# Altium schematic sheet Sheet1.SchDoc
size 594 x 420 mm; SheetNumber: 1; SheetTotal: 1
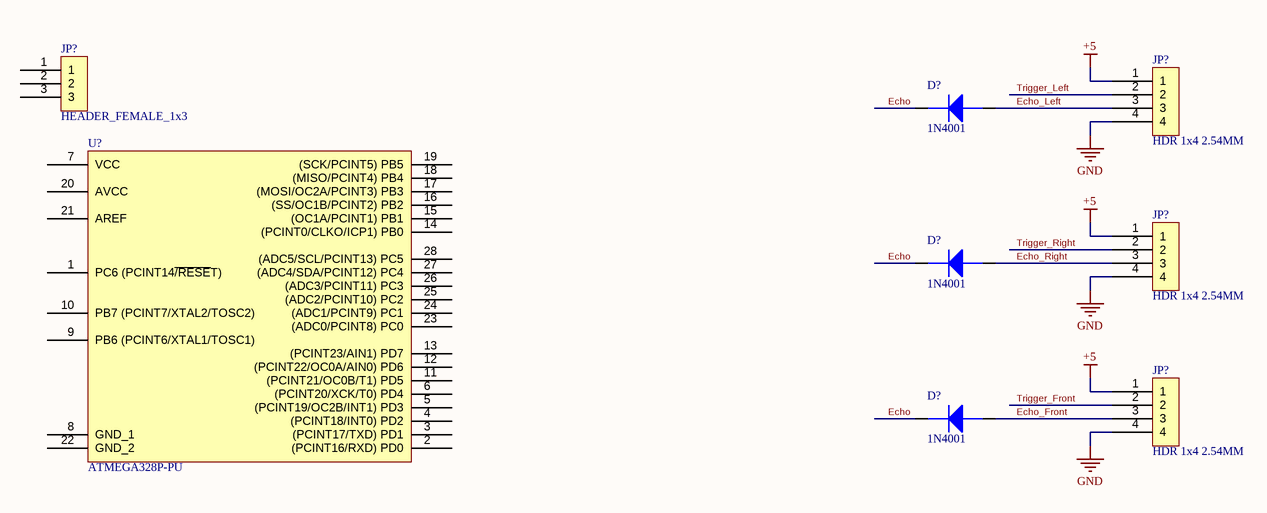
[diagram p0: Sheet1.SchDoc]

## Parts
(Parts that share a designator on the sheet are numbered #1, #2 ... from top to bottom, then left to right.)
D?#1  1N4001  [1N4001]
D?#2  1N4001  [1N4001]
D?#3  1N4001  [1N4001]
JP?#1  HEADER_FEMALE_1x3  [HDR_1x3_2.54MM]
JP?#2  HDR 1x4 2.54MM  [MALEHEADER_1x4_2.54MM]
JP?#3  HDR 1x4 2.54MM  [MALEHEADER_1x4_2.54MM]
JP?#4  HDR 1x4 2.54MM  [MALEHEADER_1x4_2.54MM]
U?  ATMEGA328P-PU  [DIP28_7.62mm]

## Nets
+5: JP?#2.1 JP?#3.1 JP?#4.1
GND: JP?#2.4 JP?#3.4 JP?#4.4
Echo: D?#1.1(Ca) D?#2.1(Ca) D?#3.1(Ca)
Echo_Front: D?#3.2(An) JP?#4.3
Echo_Left: D?#1.2(An) JP?#2.3
Echo_Right: D?#2.2(An) JP?#3.3
Trigger_Front: JP?#4.2
Trigger_Left: JP?#2.2
Trigger_Right: JP?#3.2

Not connected (* = marked no-connect by the designer): JP?#1 1 2 3; U? 1(PC6_(PCINT14~{/RESE}T)) 2((PCINT16/RXD)_PD0) 3((PCINT17/TXD)_PD1) 4((PCINT18/INT0)_PD2) 5((PCINT19/OC2B/INT1)_PD3) 6((PCINT20/XCK/T0)_PD4) 7(VCC) 8(GND_1) 9(PB6_(PCINT6/XTAL1/TOSC1)) 10(PB7_(PCINT7/XTAL2/TOSC2)) 11((PCINT21/OC0B/T1)_PD5) 12((PCINT22/OC0A/AIN0)_PD6) 13((PCINT23/AIN1)_PD7) 14((PCINT0/CLKO/ICP1)_PB0) 15((OC1A/PCINT1)_PB1) 16((SS/OC1B/PCINT2)_PB2) 17((MOSI/OC2A/PCINT3)_PB3) 18((MISO/PCINT4)_PB4) 19((SCK/PCINT5)_PB5) 20(AVCC) 21(AREF) 22(GND_2) 23((ADC0/PCINT8)_PC0) 24((ADC1/PCINT9)_PC1) 25((ADC2/PCINT10)_PC2) 26((ADC3/PCINT11)_PC3) 27((ADC4/SDA/PCINT12)_PC4) 28((ADC5/SCL/PCINT13)_PC5)

## Notes on the sheet
- DWG NO:
- REV:
- THIS DOCUMENT AND THE DATA DISCLOSED HEREIN OR
- HEREWITH IS THE PROPERTY OF ALTIUM LIMITED AND MAY
- BE FREELY DISTRIBUTED IN WHOLE. NO RIGHTS ARE
- RESERVED OR EXPRESS OR IMPLIED WARANTEE GIVEN.
- REVISION
- DESCRIPTION
- DATE
- APPROVED
- ENG:
- APPROVALS
- PROJECT
- DSN:
- CHK:
- REFERENCE DOCUMENTS
- PROJECT REVISION:
- TITLE
- DOCUMENT REVISION:
- DESIGN ITEM:
- BOM:
- FAB DWG:
- PCB DWG:
- ASSY DWG:
- SCALE:
- A2
- SIZE
- CAGE CODE
- FILE NAME
- DWG NO.
- SHEET
- OF
- REV

## Library data of the parts
D?#1-D?#3 = 1N4001: Rectifier Diode, 1 Element, 1A, 50V V(RRM), Silicon, DO-41; Manufacturer: ON Semiconductor / Fairchild; Max Reverse Current: 5uA; Max Surge Current: 30A; Element Configuration: Single; Forward Voltage: 1.1V; Polarity: Standard; Capacitance: 15pF; Power Dissipation: 3W; Supplier 1: Avnet; Manufacturer Part Number: 1N4001; RoHS: Yes; Category: Rectifier Diodes; Stock 1: 326522; Pricing 1: 32052=0.01000 (USD); Mount: Through Hole; Number of Pins: 2; Contact Plating: Tin,Matte; Weight: 0.245g; Min Operating Temperature: -55°C; Max Operating Temperature: 175°C; Packaging: Tape and Reel; Max Repetitive Reverse Voltage (Vrrm): 50V; Max Forward Surge Current (Ifsm): 30A; Package Quantity: 1000; Average Rectified Current: 1A; Peak Non-Repetitive Surge Current: 30A; Max Reverse Voltage (DC): 50V; Reverse Voltage: 50V; Forward Current: 1A; Voltage Rating (DC): 50V; Current Rating: 1A; Output Current: 1A; Diameter: 2.72mm; Length: 5.2mm; Width: 0.25inch; Height: 5.2mm; Radiation Hardening: No; RoHS Compliant: Yes; REACH SVHC: No SVHC; Lead Free: Lead Free; ComponentLink1URL: https://datasheet.ciiva.com/910/1n4001-910352.pdf?src-supplier=Avnet; ComponentLink1Description: https://datasheet.ciiva.com/910/1n4001-910352.pdf?src-supplier=Avnet; ComponentLink2URL: https://datasheet.ciiva.com/910/1n4001-910352.pdf?src-supplier=Digi-Key; ComponentLink2Description: https://datasheet.ciiva.com/910/1n4001-910352.pdf?src-supplier=Digi-Key; ComponentLink3URL: https://datasheet.ciiva.com/4452/1n4004-81693-4452416.pdf?src-supplier=Mouser; ComponentLink3Description: https://datasheet.ciiva.com/4452/1n4004-81693-4452416.pdf?src-supplier=Mouser; ComponentLink4URL: https://datasheet.ciiva.com/30479/0900766b810c07cd-30479188.pdf?src-supplier=RSComponents; ComponentLink4Description: https://datasheet.ciiva.com/30479/0900766b810c07cd-30479188.pdf?src-supplier=RSComponents; ComponentLink5URL: https://datasheet.ciiva.com/15208/getdatasheetpartid-148723-15208346.pdf?src-supplier=Verical; ComponentLink5Description: https://datasheet.ciiva.com/15208/getdatasheetpartid-148723-15208346.pdf?src-supplier=Verical; ComponentLink6URL: https://datasheet.ciiva.com/8084/1n4007-8084076.pdf?src-supplier=Avnet; ComponentLink6Description: https://datasheet.ciiva.com/8084/1n4007-8084076.pdf?src-supplier=Avnet; ComponentLink7URL: https://datasheet.ciiva.com/910/1n4001-910353.pdf?src-supplier=Digi-Key; ComponentLink7Description: https://datasheet.ciiva.com/910/1n4001-910353.pdf?src-supplier=Digi-Key; ComponentLink8URL: https://datasheet.ciiva.com/927/1n4001-d-927540.pdf?src-supplier=Digi-Key; ComponentLink8Description: https://datasheet.ciiva.com/927/1n4001-d-927540.pdf?src-supplier=Digi-Key; ComponentLink9URL: https://datasheet.ciiva.com/22651/1923868-22651932.pdf?src-supplier=Element14; ComponentLink9Description: https://datasheet.ciiva.com/22651/1923868-22651932.pdf?src-supplier=Element14; ComponentLink10URL: https://datasheet.ciiva.com/22685/1504060-22685765.pdf?src-supplier=Element14; ComponentLink10Description: https://datasheet.ciiva.com/22685/1504060-22685765.pdf?src-supplier=Element14; Supplier Part Number 1: 1N4001
JP?#1 = 68000-103HLF: Conn Unshrouded Header HDR 3 POS 2.54mm Solder ST Top Entry Thru-Hole BergStik® Automotive Bulk; Manufacturer: Amphenol ICC; Supplier 1: Allied Electronics; Manufacturer Part Number: 68000-103HLF; RoHS: Yes; Category: Headers and Wire Housings; RoHS Compliant: Yes; ComponentLink1URL: http://www.farnell.com/cad/1914865.pdf?src-supplier=Farnell; ComponentLink1Description: http://www.farnell.com/cad/1914865.pdf?src-supplier=Farnell; ComponentLink2URL: http://www.farnell.com/cad/1914865.pdf?src-supplier=Element14; ComponentLink2Description: http://www.farnell.com/cad/1914865.pdf?src-supplier=Element14; ComponentLink3URL: http://www.farnell.com/cad/1914865.pdf?src-supplier=Newark; ComponentLink3Description: http://www.farnell.com/cad/1914865.pdf?src-supplier=Newark; ComponentLink4URL: https://cdn.amphenol-icc.com/media/wysiwyg/files/drawing/68000.pdf?src-supplier=Digi-Key; ComponentLink4Description: https://cdn.amphenol-icc.com/media/wysiwyg/files/drawing/68000.pdf?src-supplier=Digi-Key; Supplier Part Number 1: 70236888
JP?#2-JP?#4 = 68001-204HLF: Conn Unshrouded Header HDR 4 POS 2.54mm Solder ST Thru-Hole Bag; Manufacturer: Amphenol ICC / FCI; Supplier 1: Allied Electronics; Manufacturer Part Number: 68001-204HLF; RoHS: No; Category: Headers and Wire Housings; Supplier Part Number 1: 70302499
U? = ATMEGA328P-PU: ATMEGA328P-PU; 8 bit Microcontroller AVR 20MHz 1; 32kb Flash; 2kb RAM; I2C SPI 2; Manufacturer: Microchip / Atmel; Number of PWM Channels: 6; Number of Timers/Counters: 3; Min Supply Voltage: 1.8V; Max Supply Voltage: 5.5V; Interface: I2C,SPI,UART,USART,2-Wire; Number of I/Os: 23; Oscillator Type: Internal; Data Bus Width: 8b; Number of SPI Channels: 1; Watchdog Timer: Yes; Peripherals: Brown-out Detect/Reset,POR,PWM,WDT; Supplier 1: Allied Electronics; Manufacturer Part Number: ATMEGA328P-PU; RoHS: Yes; Category: Microcontrollers; Mount: Through Hole; Case/Package: PDIP; Number of Pins: 28; Contact Plating: Tin,Matte; Min Operating Temperature: -40°C; Max Operating Temperature: 85°C; Package Quantity: 14; Core Architecture: AVR; RAM Size: 2KB; Number of ADC Channels: 6; Packaging: Rail/Tube; Frequency: 20MHz; Number of Programmable I/O: 23; Max Frequency: 20MHz; Number of I2C Channels: 1; Memory Type: FLASH; Memory Size: 32KB; Series: AVR® ATmega; Length: 37.4mm; Width: 6.76mm; Height: 3.28mm; Radiation Hardening: No; REACH SVHC: No SVHC; Lead Free: Lead Free; RoHS Compliant: Yes; ComponentLink1URL: https://datasheet.ciiva.com/19457/2139111-19457070.pdf?src-supplier=Jameco; ComponentLink1Description: https://datasheet.ciiva.com/19457/2139111-19457070.pdf?src-supplier=Jameco; ComponentLink2URL: https://datasheet.ciiva.com/1157/1684409-1157696.pdf?src-supplier=Element14; ComponentLink2Description: https://datasheet.ciiva.com/1157/1684409-1157696.pdf?src-supplier=Element14; ComponentLink3URL: https://datasheet.ciiva.com/20168/73-4283-20168380.pdf?src-supplier=Rapid+Electronics; ComponentLink3Description: https://datasheet.ciiva.com/20168/73-4283-20168380.pdf?src-supplier=Rapid+Electronics; ComponentLink4URL: https://datasheet.ciiva.com/29119/155197-da-01-en-microcontr-atmega328p-pu-8bit-pdip-28-29119593.pdf?src-supplier=Conrad; ComponentLink4Description: https://datasheet.ciiva.com/29119/155197-da-01-en-microcontr-atmega328p-pu-8bit-pdip-28-29119593.pdf?src-supplier=Conrad; ComponentLink5URL: https://datasheet.ciiva.com/26818/atmega328p-pu-26818578.pdf?src-supplier=IIIC; ComponentLink5Description: https://datasheet.ciiva.com/26818/atmega328p-pu-26818578.pdf?src-supplier=IIIC; ComponentLink6URL: https://datasheet.ciiva.com/15213/getdatasheetpartid-318533-15213133.pdf?src-supplier=Verical; ComponentLink6Description: https://datasheet.ciiva.com/15213/getdatasheetpartid-318533-15213133.pdf?src-supplier=Verical; Supplier Part Number 1: 70332157